# Altium schematic sheet E-13 USB2 C.SchDoc: FRDM-IMX93
size 513 x 386 mm; DrawnBy: FORLINX; Organization: ORGANIZATION; Address1: ADDRESS 1; Address2: ADDRESS 2; Address3: ADDRESS 3; Address4: ADDRESS 4; Revision: -; ENG_APP_DATE: --/--/--; DSN_APP_DATE: --/--/--; CHK_APP_DATE: --/--/--; Classification: Public, Company Internal/Proprietary, Company Confidential,  Company Secret; Page Create Date: March  8, 1995; OrgName: NXP Semiconductor; FIUO: A; OrgAddr1: NO. 192 Liangjing Rd. Pudong New Area, ShangHai; Page Number: 13; PageTitle: USB2 Type-C; Page Size: C; Page Count: 23; Designer: FORLINX; RevCode: B1; Approver: NXP SE; Doc: SCH-94611 PDF: SPF-94611; DsnPath: T:\FILES\Designs\Single Board Computers\i.MX93-FRDM\Design Files\SCH-94611_B1.DSN; SchematicName: FRDM-i.MX 93 Development Board; PageName: E-13 USB2 C; PageSize: C; TopSchematic: True
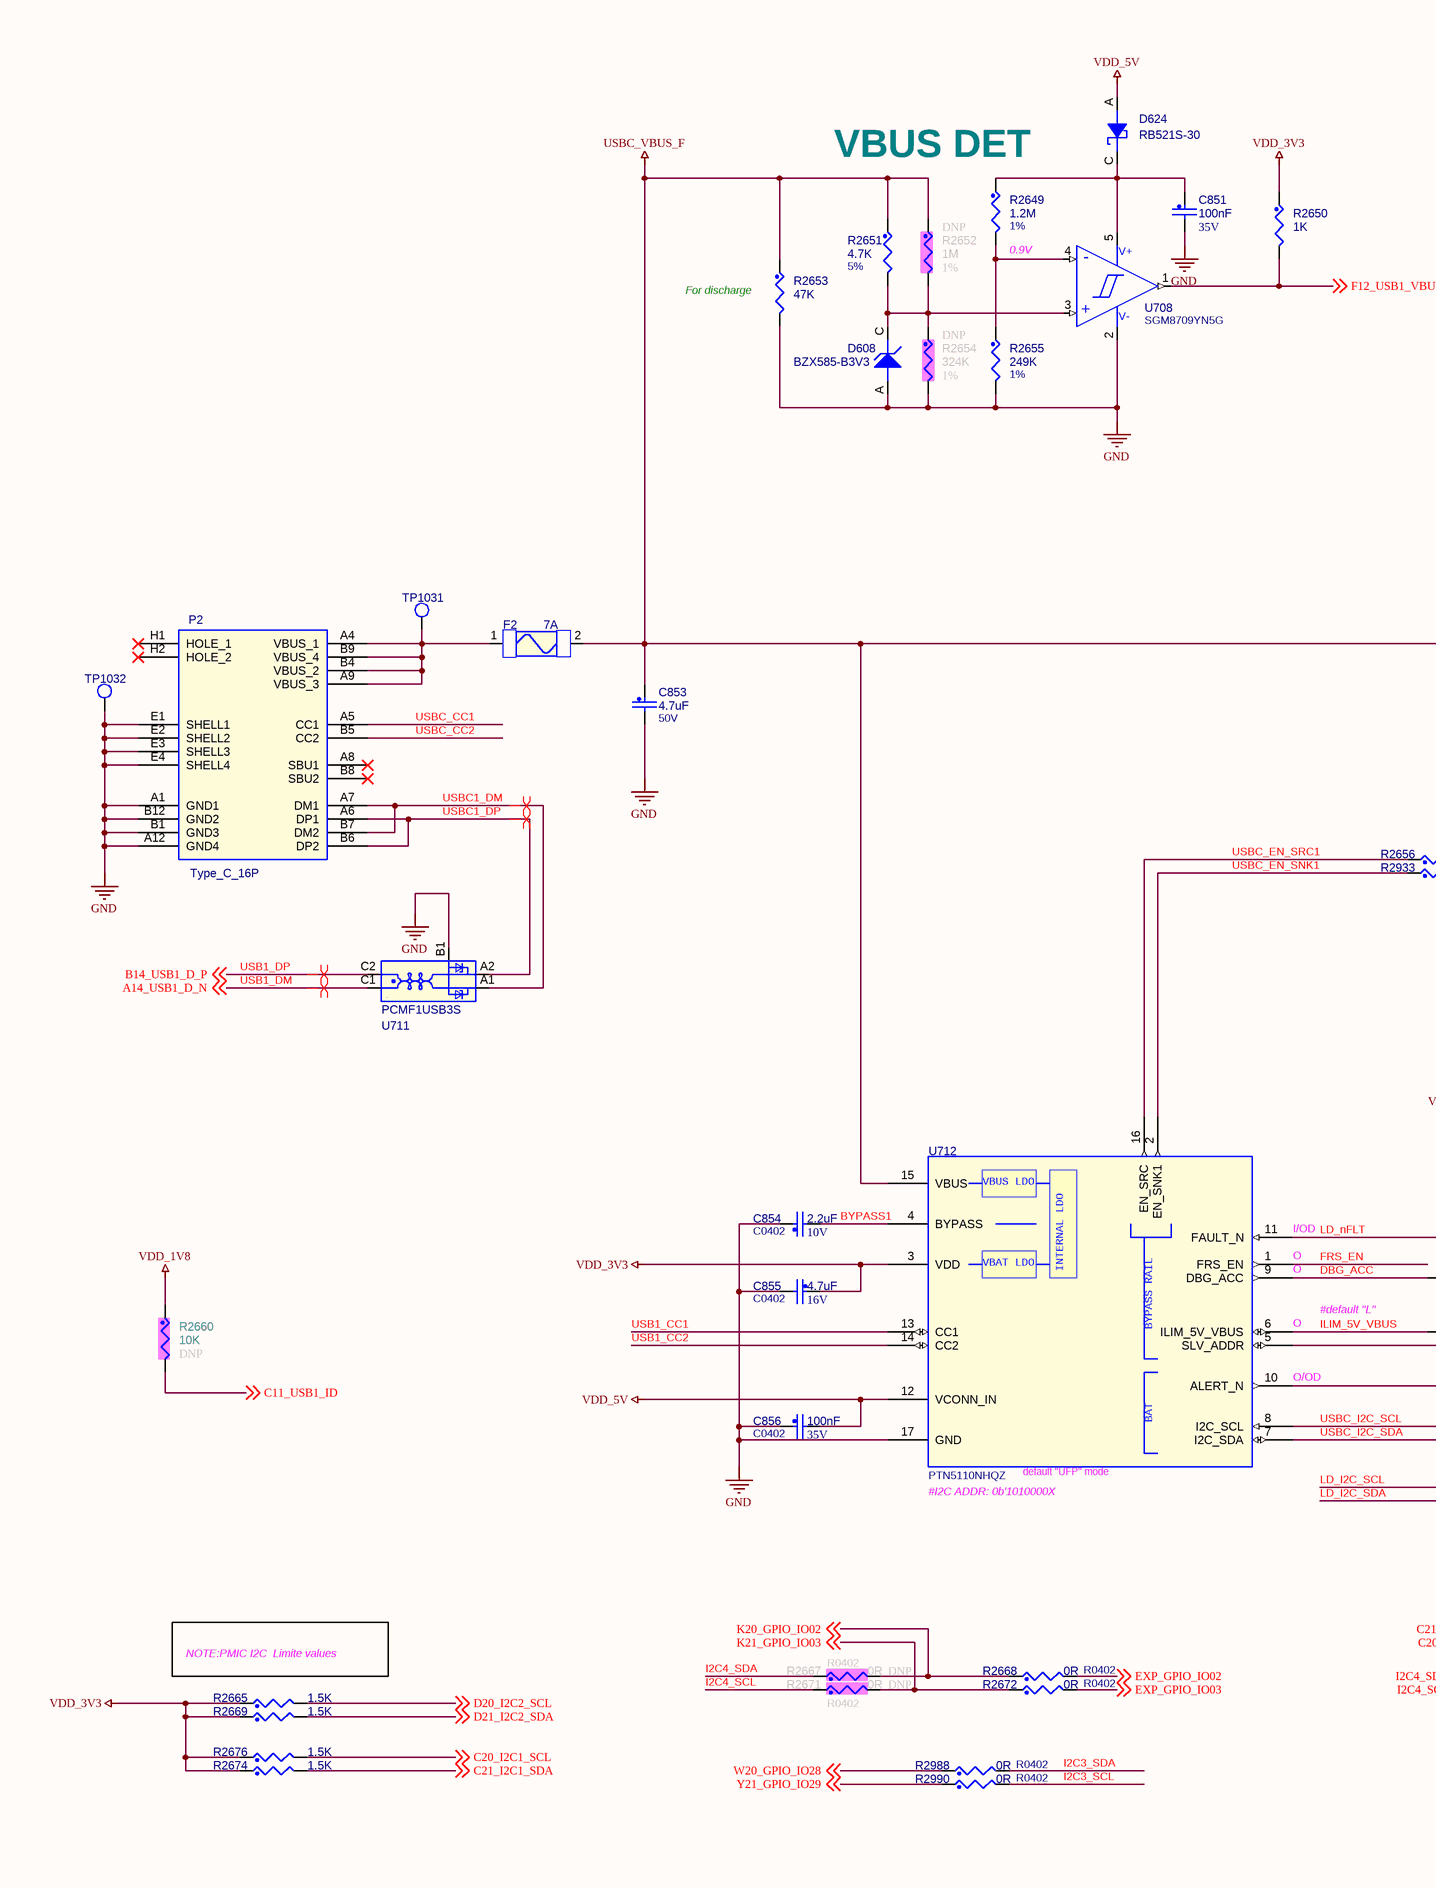
[diagram p0: E-13 USB2 C.SchDoc, left]
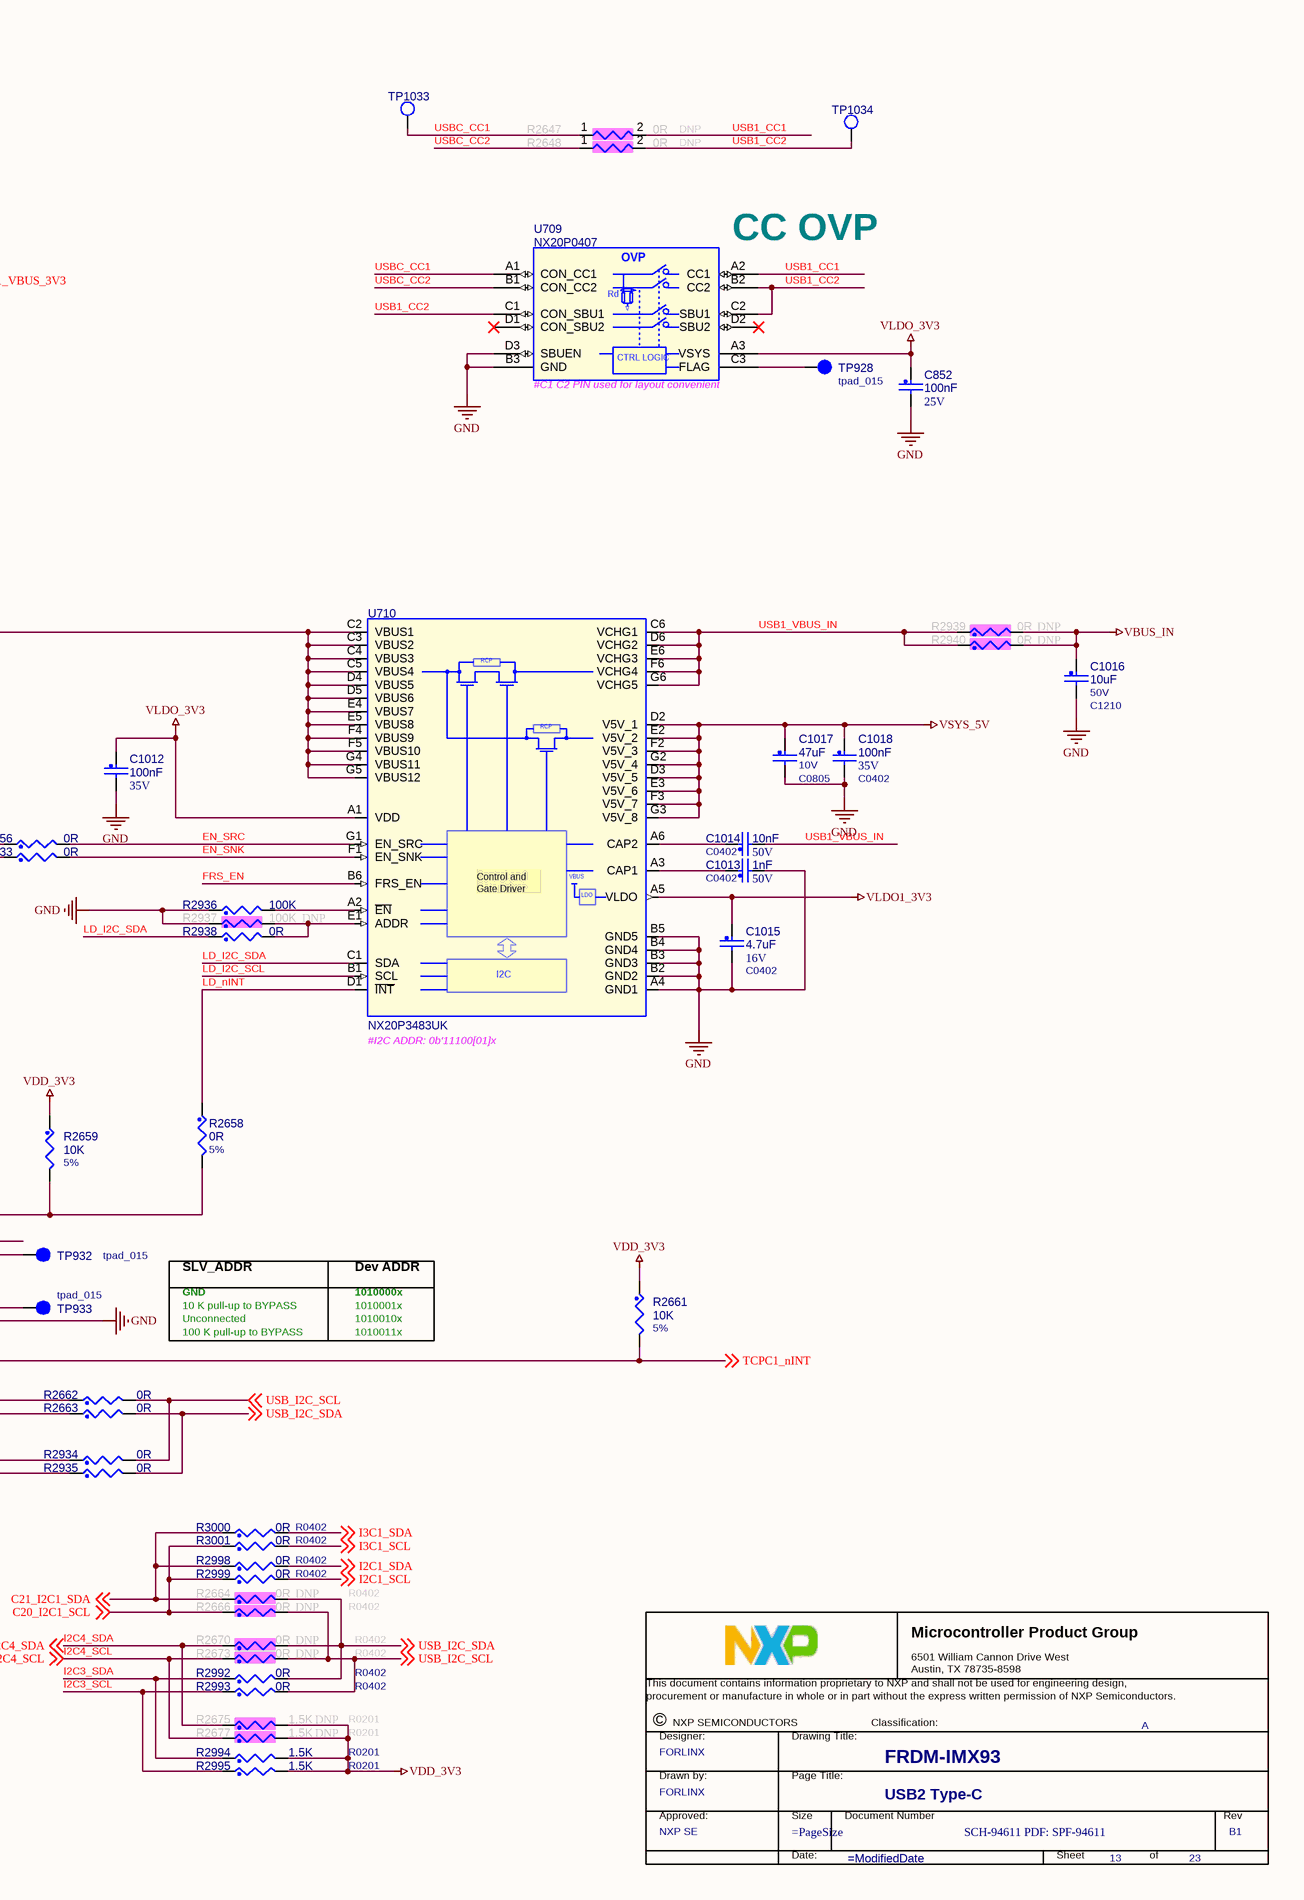
[diagram p1: E-13 USB2 C.SchDoc, right]

## Parts
*  Title: FRDM-IMX93  RevCode: B1  PageTitle: USB2 Type-C  Page Number: 13  Page Count: 23  DrawnBy: FORLINX  Doc: SCH-94611 PDF: SPF-94611  Approver: NXP SE  FIUO: A  (graphical)
C851  100nF  VOLTAGE: 35V  [C0402]
C852  100nF  VOLTAGE: 25V  [C0201]
C853  4.7uF  VOLTAGE: 50V  [C1210]
C854  2.2uF  VOLTAGE: 10V  [C0402]
C855  4.7uF  VOLTAGE: 16V  [C0402]
C856  100nF  VOLTAGE: 35V  [C0402]
C1012  100nF  VOLTAGE: 35V  [C0402]
C1013  1nF  VOLTAGE: 50V  [C0402]
C1014  10nF  VOLTAGE: 50V  [C0402]
C1015  4.7uF  VOLTAGE: 16V  [C0402]
C1016  10uF  VOLTAGE: 50V  [C1210]
C1017  47uF  VOLTAGE: 10V  [C0805]
C1018  100nF  VOLTAGE: 35V  [C0402]
D608  BZX585-B3V3  [sod523]
D624  RB521S-30  [SOD523]
F2  7A  [fuse_3p4x1p8]
P2  Type_C_16P  [TypeC_16P_S]
R2647  0R  ASSY_OPT: DNP  [R0201]
R2648  0R  ASSY_OPT: DNP  [R0201]
R2649  1.2M  Tolerance: 1%  [R0402]
R2650  1K  [R0201]
R2651  4.7K  Tolerance: 5%  [R0402]
R2652  1M  ASSY_OPT: DNP  Tolerance: 1%  [R0402]
R2653  47K  [R0603]
R2654  324K  ASSY_OPT: DNP  Tolerance: 1%  [R0402]
R2655  249K  Tolerance: 1%  [R0402]
R2656  0R  [R0201]
R2658  0R  Tolerance: 5%  [R0201]
R2659  10K  Tolerance: 5%  [R0201]
R2660  10K  ASSY_OPT: DNP  [R0201]
R2661  10K  Tolerance: 5%  [R0201]
R2662  0R  [R0201]
R2663  0R  [R0201]
R2664  0R  ASSY_OPT: DNP  [R0402]
R2665  1.5K  [R0201]
R2666  0R  ASSY_OPT: DNP  [R0402]
R2667  0R  ASSY_OPT: DNP  [R0402]
R2668  0R  [R0402]
R2669  1.5K  [R0201]
R2670  0R  ASSY_OPT: DNP  [R0402]
R2671  0R  ASSY_OPT: DNP  [R0402]
R2672  0R  [R0402]
R2673  0R  ASSY_OPT: DNP  [R0402]
R2674  1.5K  [R0201]
R2675  1.5K  ASSY_OPT: DNP  [R0201]
R2676  1.5K  [R0201]
R2677  1.5K  ASSY_OPT: DNP  [R0201]
R2933  0R  [R0201]
R2934  0R  [R0201]
R2935  0R  [R0201]
R2936  100K  [R0201]
R2937  100K  ASSY_OPT: DNP  [R0201]
R2938  0R  [R0201]
R2939  0R  ASSY_OPT: DNP  [R0805]
R2940  0R  ASSY_OPT: DNP  [R0805]
R2988  0R  [R0402]
R2990  0R  [R0402]
R2992  0R  [R0402]
R2993  0R  [R0402]
R2994  1.5K  [R0201]
R2995  1.5K  [R0201]
R2998  0R  [R0402]
R2999  0R  [R0402]
R3000  0R  [R0402]
R3001  0R  [R0402]
TP928  TPAD_015  [tpad_015]
TP932  TPAD_015  [tpad_015]
TP933  TPAD_015  [tpad_015]
TP1031  TPAD_020  [tpad_020]  (value not drawn)
TP1032  TPAD_020  [tpad_020]  (value not drawn)
TP1033  TPAD_020  [tpad_020]  (value not drawn)
TP1034  TPAD_020  [tpad_020]  (value not drawn)
U708  SGM8709YN5G  [SOT-23-5]
U709  NX20P0407  [wlcsp12_0p4_1p3x1p7mm_smdp]
U710  NX20P3483UK  [wlcsp42_0p4_2p94x2p54_smdp]
U711  PCMF1USB3S  [wlcsp5_0p4_0p82x1p22]
U712  MFG_PN01: PTN5110NHQZ  [hx2qfn16_0p4_2p7x2p7]  (hidden comment: PTN5110)

## Nets
GND: C851.2 C852.2 C853.2 C854.1 C855.2 C856.1 C1012.2 C1013.2 C1015.2 C1016.2 C1017.2 C1018.2 D608.A(ANODE) P2.A1(GND1) P2.A12(GND4) P2.B1(GND3) P2.B12(GND2) P2.E1(SHELL1) P2.E2(SHELL2) P2.E3(SHELL3) P2.E4(SHELL4) R2653.2 R2654.2 R2655.2 R2936.1 R2937.1 TP1032.1(TP) U708.2(V-) U709.B3(GND) U709.D3(SBUEN) U710.A4(GND1) U710.B2(GND2) U710.B3(GND3) U710.B4(GND4) U710.B5(GND5) U711.B1(GND) U712.5(SLV_ADDR) U712.17(GND)
USBC_VBUS_F: C853.1 F2.2 R2651.1 R2652.1 R2653.1 U710.C2(VBUS1) U710.C3(VBUS2) U710.C4(VBUS3) U710.C5(VBUS4) U710.D4(VBUS5) U710.D5(VBUS6) U710.E4(VBUS7) U710.E5(VBUS8) U710.F4(VBUS9) U710.F5(VBUS10) U710.G4(VBUS11) U710.G5(VBUS12) U712.15(VBUS)
VBUS_IN: C1016.1 R2939.2 R2940.2
VDD_1V8: R2660.1
VDD_3V3: C855.1 R2650.1 R2659.1 R2661.1 R2665.1 R2669.1 R2674.1 R2675.2 R2676.1 R2677.2 R2994.2 R2995.2 U712.3(VDD)
VDD_5V: C856.2 D624.A U712.12(VCONN_IN)
VLDO1_3V3: C1015.1 U710.A5(VLDO)
VLDO_3V3: C852.1 C1012.1 U709.A3(VSYS) U710.A1(VDD)
VSYS_5V: C1017.1 C1018.1 U710.D2(V5V_1) U710.D3(V5V_5) U710.E2(V5V_2) U710.E3(V5V_6) U710.F2(V5V_3) U710.F3(V5V_7) U710.G2(V5V_4) U710.G3(V5V_8)
BYPASS1: C854.2 U712.4(BYPASS)
C11_USB1_ID: R2660.2 ; off-sheet C11_USB1_ID
C20_I2C1_SCL: R2666.1 R2676.2 R2999.1 R3001.1 ; off-sheet C20_I2C1_SCL
C21_I2C1_SDA: R2664.1 R2674.2 R2998.1 R3000.1 ; off-sheet C21_I2C1_SDA
D20_I2C2_SCL: R2665.2 ; off-sheet D20_I2C2_SCL
D21_I2C2_SDA: R2669.2 ; off-sheet D21_I2C2_SDA
DBG_ACC: TP932.1(Pin1) U712.9(DBG_ACC)
EN_SNK: R2933.2 U710.F1(EN_SNK)
EN_SRC: R2656.2 U710.G1(EN_SRC)
EXP_GPIO_IO02: R2668.2 ; off-sheet EXP_GPIO_IO02
EXP_GPIO_IO03: R2672.2 ; off-sheet EXP_GPIO_IO03
F12_USB1_VBUS_3V3: R2650.2 U708.1(OUT) ; off-sheet F12_USB1_VBUS_3V3
FRS_EN: U710.B6(FRS_EN) U712.1(FRS_EN)
I2C1_SCL: R2999.2 ; off-sheet I2C1_SCL
I2C1_SDA: R2998.2 ; off-sheet I2C1_SDA
I2C3_SCL: R2990.2 R2993.1 R2995.1
I2C3_SDA: R2988.2 R2992.1 R2994.1
I2C4_SCL: R2671.1 R2673.1 R2677.1 ; off-sheet I2C4_SCL
I2C4_SDA: R2667.1 R2670.1 R2675.1 ; off-sheet I2C4_SDA
I3C1_SCL: R3001.2 ; off-sheet I3C1_SCL
I3C1_SDA: R3000.2 ; off-sheet I3C1_SDA
ILIM_5V_VBUS: TP933.1(Pin1) U712.6(ILIM_5V_VBUS)
K20_GPIO_IO02: R2667.2 R2668.1 ; off-sheet K20_GPIO_IO02
K21_GPIO_IO03: R2671.2 R2672.1 ; off-sheet K21_GPIO_IO03
LD_I2C_SCL: R2934.1 U710.B1(SCL)
LD_I2C_SDA: R2935.1 R2938.1 U710.C1(SDA)
LD_nFLT: R2658.2 R2659.2 U712.11(FAULT_N)
LD_nINT: R2658.1 U710.D1(~{INT})
TCPC1_nINT: R2661.2 U712.10(ALERT_N) ; off-sheet TCPC1_nINT
USB1_CC1: R2647.2 U709.A2(CC1) U712.13(CC1)
USB1_CC2: R2648.2 TP1034.1(TP) U709.B2(CC2) U709.C1(CON_SBU1) U709.C2(SBU1) U712.14(CC2)
USB1_DM: U711.C1(CH1_OUT+) ; off-sheet A14_USB1_D_N  [also labelled A14_USB1_D_N]
USB1_DP: U711.C2(CH1_OUT-) ; off-sheet B14_USB1_D_P  [also labelled B14_USB1_D_P]
USB1_VBUS_IN: C1014.2 R2939.1 R2940.1 U710.C6(VCHG1) U710.D6(VCHG2) U710.E6(VCHG3) U710.F6(VCHG4) U710.G6(VCHG5)
USB_I2C_SCL: R2662.2 R2666.2 R2673.2 R2934.2 R2993.2 ; off-sheet USB_I2C_SCL
USB_I2C_SDA: R2663.2 R2664.2 R2670.2 R2935.2 R2992.2 ; off-sheet USB_I2C_SDA
USBC1_DM: P2.A7(DM1) P2.B7(DM2) U711.A1(CH1_IN+)
USBC1_DP: P2.A6(DP1) P2.B6(DP2) U711.A2(CH1_IN-)
USBC_CC1: P2.A5(CC1) R2647.1 TP1033.1(TP) U709.A1(CON_CC1)
USBC_CC2: P2.B5(CC2) R2648.1 U709.B1(CON_CC2)
USBC_EN_SNK1: R2933.1 U712.2(EN_SNK1)
USBC_EN_SRC1: R2656.1 U712.16(EN_SRC)
USBC_I2C_SCL: R2662.1 U712.8(I2C_SCL)
USBC_I2C_SDA: R2663.1 U712.7(I2C_SDA)
W20_GPIO_IO28: R2988.1 ; off-sheet W20_GPIO_IO28
Y21_GPIO_IO29: R2990.1 ; off-sheet Y21_GPIO_IO29
NetC851_1: C851.1 D624.C R2649.1 U708.5(V+)
NetC1013_1: C1013.1 U710.A3(CAP1)
NetC1014_1: C1014.1 U710.A6(CAP2)
NetD608_C: D608.C(CATHODE) R2651.2 R2652.2 R2654.1 U708.3(+IN)
NetF2_1: F2.1 P2.A4(VBUS_1) P2.A9(VBUS_3) P2.B4(VBUS_2) P2.B9(VBUS_4) TP1031.1(TP)
NetR2649_2: R2649.2 R2655.1 U708.4(-IN)
NetR2936_2: R2936.2 U710.A2(~{EN})
NetR2937_2: R2937.2 R2938.2 U710.E1(ADDR)
NetTP928_1: TP928.1(Pin1) U709.C3(FLAG)

Not connected (* = marked no-connect by the designer): P2 A8(SBU1)* B8(SBU2)* H1(HOLE_1)* H2(HOLE_2)*; U709 D1(CON_SBU2)* D2(SBU2)*

## Layout directives
differential pair: USB1_DM, USB1_DP, USBC1_DM, USBC1_DP

## Notes on the sheet
- (near R2649) VBUS DET
- (near R2649) 0.9V
- (near U709) CC OVP
- (near R2653) For discharge
- (near U709) #C1 C2 PIN used for layout convenient
- (near U710) #I2C ADDR: 0b'11100[01]x
- (near U712) O
- (near U712) I/OD
- #default "L"
- GND
- 10 K pull-up to BYPASS
- SLV_ADDR
- 1010001x
- Dev ADDR
- 1010000x
- (near U712) O/OD
- 100 K pull-up to BYPASS
- Unconnected
- 1010011x
- 1010010x
- (near U712) #I2C ADDR: 0b'1010000X
- (near U712) default "UFP" mode
- NOTE:PMIC I2C  Limite values
- DWG. NO.
- REV.
- SHT.
- REVISION
- DESCRIPTION
- DATE
- APPROVED
- ENG:
- APPROVALS
- quilter.ai <http://quilter.ai>
- DSN:
- CHK:
- REFERENCE DOCUMENTS
- TITLE
- PROJECT
- BOM:
- FAB DWG:
- PCB DWG:
- ASSY DWG:
- SIZE
- FILE NAME
- C
- DWG NO.
- SHEET
- OF
- REV
- (in symbol NX20P0407_WLCSP12_A) OVP; Rd; CTRL LOGIC
- (in symbol NX20P3483UK_42P) RCP; VBUS; Control and / Gate Driver; LDO; I2C
- (in symbol PTN5110_QFN16) VBUS LDO; VBAT LDO; INTERNAL LDO; BYPASS RAIL; BAT
- (in symbol SGM8709YN5G) -; +
- (in symbol TitleBlock_MCPG) Microcontroller Product Group; 6501 William Cannon Drive West / Austin, TX 78735-8598; This document contains information proprietary to NXP and shall not be used for engineering design,; procurement or manufacture in whole or in part without the express written permission of NXP Semiconductors.; ©; NXP SEMICONDUCTORS; Classification:; Designer:; Drawing Title:; Drawn by:; Page Title:; Approved:; Size; Document Number; Rev; Date:; Sheet; of

## Library data of the parts
* = TitleBlock_MCPG: Classification: Public, Company Internal/Proprietary, Company Confidential,  Company Secret; OrgAddr1: NO. 192 Liangjing Rd. Pudong New Area, ShangHai; OrgName: NXP Semiconductor; Page Size: =PageSize; Page Create Date: March  8, 1995; Designer: FORLINX; Page Modify Date: =ModifiedDate
C851 = CAP_NP: 0402,100nF,50V,+/-10%,X5R; Part Reference: C851; CLASS: DISCRETE; Tolerance: 10%; MFG_NAME01: FENGHUA; MFG_PN01: 0402X104K500NT; CAD_APPROVED: Yes; FPLIST: CC0402_25,CC0402_HD,0402_CC,capc0402_l; Value: 100nF; ROHS: Yes; HEIGHT: 0.55MM; PCB Footprint: C0402
C852 = CAP_NP: 0201,100nF,25V,+/-10%,X5R; Part Reference: C852; CLASS: DISCRETE; FPLIST: CC0402_25,CC0402_HD,0402_CC,capc0402_l; CAD_APPROVED: Yes; MFG_PN01: 0201X104K250NT; MFG_NAME01: FENGHUA; Tolerance: 10%; Value: 100nF; HEIGHT: 0.55MM; ROHS: Yes; PCB Footprint: C0201
C853 = CAP_NP: 1210,4.7uF,50V,+/-10%,X7R; Part Reference: C853; CLASS: DISCRETE; Tolerance: 10%; MFG_NAME01: MURATA; MFG_PN01: GRM32ER71H475KA88L; CAD_APPROVED: Yes; FPLIST: CC1210,1210_CC; Value: 4.7uF; ROHS: Yes; HEIGHT: 2.7MM; PCB Footprint: C1210
C854 = CAP_NP: 0402,2.2uF,10V,+/-10%,X5R; Part Reference: C854; CLASS: DISCRETE; Tolerance: 10%; MFG_NAME01: SAMSUNG; MFG_PN01: CL05A225KP5NSNC; CAD_APPROVED: Yes; FPLIST: CC0402_25,CC0402_HD,0402_CC,capc0402_l; Value: 2.2uF; Package Size: 0402; ROHS: Yes; HEIGHT: 0.55 MM; PCB Footprint: C0402
C855 = CAP_NP: 0402,4.7uF,10V,+/-10%,X5R; Part Reference: C855; CLASS: DISCRETE; Temp Range: -55¡ãC to + 85¡ãC; FPLIST: CC0603_OV,CC0603,cc0603_0805_nsp,0603_CC_NSP; CAD_APPROVED: Yes; MFG_PN01: CL05A475KP5NRNC; MFG_NAME01: SAMSUNG; Value: 4.7uF; HEIGHT: 0.95MM; ROHS: Yes; PCB Footprint: C0402
C856 = CAP_NP: 0402,100nF,50V,+/-10%,X5R; Part Reference: C856; CLASS: DISCRETE; FPLIST: CC0402_25,CC0402_HD,0402_CC,capc0402_l; CAD_APPROVED: Yes; MFG_PN01: 0402X104K500NT; MFG_NAME01: FENGHUA; Tolerance: 10%; Value: 100nF; HEIGHT: 0.55MM; ROHS: Yes; PCB Footprint: C0402
C1012 = CAP_NP: 0402,100nF,50V,+/-10%,X5R; Part Reference: C1012; CLASS: DISCRETE; FPLIST: CC0402_25,CC0402_HD,0402_CC,capc0402_l; CAD_APPROVED: Yes; MFG_PN01: 0402X104K500NT; MFG_NAME01: FENGHUA; Tolerance: 10%; Value: 100nF; HEIGHT: 0.55MM; ROHS: Yes; PCB Footprint: C0402
C1013 = CAP_NP: 0402,1nF,50V,+/-10%,X7R; Part Reference: C1013; CLASS: DISCRETE; Tolerance: 10%; MFG_NAME01: FENGHUA; MFG_PN01: 0402B102K500NT; CAD_APPROVED: Yes; FPLIST: CC0402_25,CC0402_HD,0402_CC,capc0402_l; Value: 1nF; ROHS: Yes; HEIGHT: 0.55MM; PCB Footprint: C0402
C1014 = CAP_NP: 0402,10nF,50V,+/-10%,X7R; Part Reference: C1014; CLASS: DISCRETE; Tolerance: 10%; MFG_NAME01: FENGHUA; MFG_PN01: 0402CG103J500NT; CAD_APPROVED: Yes; FPLIST: CC0402_25,CC0402_HD,0402_CC,capc0402_l; Value: 10nF; ROHS: Yes; HEIGHT: 0.55MM; PCB Footprint: C0402
C1015 = CAP_NP: 0402,4.7uF,10V,+/-10%,X5R; Part Reference: C1015; CLASS: DISCRETE; Tolerance: 10%; MFG_NAME01: SAMSUNG; MFG_PN01: CL05A475KP5NRNC; CAD_APPROVED: Yes; FPLIST: CC0402_25,CC0402_HD,0402_CC,capc0402_l; Value: 4.7uF; ROHS: Yes; HEIGHT: 0.55MM; PCB Footprint: C0402
C1016 = CAP_NP: 1210,10uF,50V,+/-10%,X7R; Part Reference: C1016; CLASS: DISCRETE; Tolerance: 10%; MFG_NAME01: SAMSUNG; MFG_PN01: CL32B106KBJNNNE; CAD_APPROVED: Yes; FPLIST: CC1210,1210_CC; Value: 10uF; ROHS: Yes; HEIGHT: 2.7MM; PCB Footprint: C1210
C1017 = CAP_NP: 0805,47uF,10V,+/-20%,X5R; Part Reference: C1017; CLASS: DISCRETE; Tolerance: 10%; MFG_NAME01: MURATA; MFG_PN01: GRM21BR61A476ME15L; CAD_APPROVED: Yes; FPLIST: CC1210,1210_CC; Value: 47uF; ROHS: Yes; HEIGHT: 2.7MM; PCB Footprint: C0805
C1018 = CAP_NP: 0402,100nF,50V,+/-10%,X5R; Part Reference: C1018; CLASS: DISCRETE; Tolerance: 10%; MFG_NAME01: FENGHUA; MFG_PN01: 0402X104K500NT; CAD_APPROVED: Yes; FPLIST: CC0402_25,CC0402_HD,0402_CC,capc0402_l; Value: 100nF; ROHS: Yes; HEIGHT: 0.55MM; PCB Footprint: C0402
D608 = ZDIODE: BZX585-B3V3,3.3V,SOD523; Part Reference: D608; CLASS: IC; MFG_NAME01: JSCJ; Temp_Range: -65¡ãC to +150¡ãC; CAD_APPROVED: Yes; Value: BZX585-B3V3; MFG_PN01: BZX585-B3V3; ROHS: Yes; HEIGHT: 0.65MM; Temp Range: -65¡ãC to +150¡ãC; PCB Footprint: sod523
D624 = DIODE_SCHTKY: RB521S-30C,SOD-523; Part Reference: D624; CLASS: IC; MFG_NAME01: onsemi; CAD_APPROVED: Yes; Value: RB521S-30; MFG_PN01: RB521S-30C; ROHS: Yes; HEIGHT: 0.7MM; PCB Footprint: SOD523
F2 = FUSE: Fuse,1206,7A,32V; Part Reference: F2; CLASS: DISCRETE; CAD_APPROVED: Yes; MFG_PN01: JFC1206-1700FS; MFG_NAME01: JDT fuse; Value: 7A; HEIGHT: 0.8639MM; ROHS: Yes; PCB Footprint: fuse_3p4x1p8
P2 = Type_C_16P: USB616FC-C2014216,USB2.0,type-c; Part Reference: P2; MFG_NAME01: ATOM; Value: Type_C_16P; MFG_PN01: USB616FC-C2014216; PCB Footprint: TypeC_16P_S
R2647 = RESISTOR: 0201,0Ohm,+/-5%; Part Reference: R2647; Manufacturer: YAGEO; Tolerance: 1%; MFG_NAME01: FENGHUA; RK PN: RC0402FR-0743KL; Priority: A; Wattage: 1/16W; MFG_PN01: RC-01000JT; PCB Footprint: R0201; Value: 0R; Part Type: Í¨ÓÃºñÄ¤µç×è; Manufacturer PN: RC0402FR-0743KL; Created by: YTL
R2648 = RESISTOR: 0201,0Ohm,+/-5%; Part Reference: R2648; Manufacturer: YAGEO; Tolerance: 1%; MFG_NAME01: FENGHUA; RK PN: RC0402FR-0743KL; Priority: A; Wattage: 1/16W; MFG_PN01: RC-01000JT; PCB Footprint: R0201; Value: 0R; Part Type: Í¨ÓÃºñÄ¤µç×è; Manufacturer PN: RC0402FR-0743KL; Created by: YTL
R2649 = RES: 0402,1.2M,+/-1%; Part Reference: R2649; CLASS: DISCRETE; MFG_NAME01: FENGHUA; MFG_PN01: RC-02U1204FT; Temp_Range: -55C to +155C; CAD_APPROVED: Yes; FPLIST: RC0402_25,RC0402_HD,0402_CC; VOLTAGE: 50V; Value: 1.2M; ROHS: Yes; HEIGHT: 0.40 MM; Temp Range: -55C to +155C; PCB Footprint: R0402
R2650 = RES: 0201,1K,+/-1%; Part Reference: R2650; CLASS: DISCRETE; TOL: 5%; MFG_NAME01: FENGHUA; MFG_PN01: RC-01W1001FT; CAD_APPROVED: Yes; FPLIST: RC0402_25,RC0402_HD,RC0402_X2,0402_CC,CAPC0402_L; Value: 1K; HEIGHT: 0.41mm; Tolerance: 5%; ROHS: Yes; PCB Footprint: R0201
R2651 = RES: 0402,4.7K,+/-1%; Part Reference: R2651; CLASS: DISCRETE; MFG_NAME01: FENGHUA; MFG_PN01: RC-02K4701FT; CAD_APPROVED: Yes; FPLIST: RC0402_25,RC0402_HD,0402_CC,RC0402_X2; Value: 4.7K; ROHS: Yes; HEIGHT: 0.41mm; PCB Footprint: R0402
R2652 = RES: 0402,1M,+/-1%; Part Reference: R2652; CLASS: DISCRETE; MFG_NAME01: FENGHUA; MFG_PN01: RC-02K1004FT; CAD_APPROVED: Yes; FPLIST: RC0402_25,RC0402_HD,0402_CC; Value: 1M; ROHS: Yes; HEIGHT: 0.4MM; PCB Footprint: R0402
R2653 = RES: 0603,47K,+/-1%; Part Reference: R2653; CLASS: DISCRETE; FPLIST: RC0603_OV,RC0603,0603_CC; Tolerance: 5%; CAD_APPROVED: Yes; MFG_NAME01: FENGHUA; MFG_PN01: RS-03K4702FT; Value: 47K; HEIGHT: 0.55 MM; ROHS: Yes; PCB Footprint: R0603
R2654 = RES: 0402,324K,+/-1%; Part Reference: R2654; CLASS: DISCRETE; FPLIST: RC0402_25,RC0402_HD,0402_CC; CAD_APPROVED: Yes; MFG_NAME01: FENGHUA; MFG_PN01: RC-02W3243FT; Value: 324K; HEIGHT: 0.40 MM; ROHS: Yes; PCB Footprint: R0402
R2655 = RES: 0402,249K,+/-1%; Part Reference: R2655; CLASS: DISCRETE; MFG_NAME01: FENGHUA; MFG_PN01: RC-02W2493FT; Temp_Range: -55C to +155C; CAD_APPROVED: Yes; FPLIST: RC0402_25,RC0402_HD,0402_CC; Value: 249K; ROHS: Yes; HEIGHT: 0.40 MM; Temp Range: -55C to +155C; PCB Footprint: R0402
R2656 = RES: 0201,0Ohm,+/-5%; Part Reference: R2656; CLASS: DISCRETE; VOLTAGE: 1/16W; Tolerance: 5%; MFG_NAME01: FENGHUA; MFG_PN01: RC-01000JT; CAD_APPROVED: Yes; FPLIST: RC0402_25,RC0402_HD,RC0402_X2,0402_CC; Value: 0R; HEIGHT: 0.45 MM; ROHS: Yes; PCB Footprint: R0201
R2658 = RES: 0201,0Ohm,+/-5%; Part Reference: R2658; CLASS: DISCRETE; MFG_NAME01: FENGHUA; MFG_PN01: RC-01000JT; CAD_APPROVED: Yes; FPLIST: RC0402_25,RC0402_HD,RC0402_X2,0402_CC; VOLTAGE: 1/16W; Value: 0R; ROHS: Yes; HEIGHT: 0.45 MM; PCB Footprint: R0201
R2659 = RES: 0201,10K,+/-5%; Part Reference: R2659; CLASS: DISCRETE; MFG_NAME01: FENGHUA; MFG_PN01: RC-01W103JT; CAD_APPROVED: Yes; FPLIST: RC0402_25,RC0402_HD,0402_CC; Value: 10K; ROHS: Yes; HEIGHT: 0.4 MM; PCB Footprint: R0201
R2660 = RES: 0201,10K,+/-5%; Part Reference: R2660; CLASS: DISCRETE; TOL: 5%; MFG_NAME01: FENGHUA; MFG_PN01: RC-01W103JT; CAD_APPROVED: Yes; FPLIST: RC0402_25,RC0402_HD,RC0402_X2,0402_CC,CAPC0402_L; Value: 10K; HEIGHT: 0.41mm; Tolerance: 5%; ROHS: Yes; PCB Footprint: R0201
R2661 = RES: 0201,10K,+/-5%; Part Reference: R2661; CLASS: DISCRETE; MFG_NAME01: FENGHUA; MFG_PN01: RC-01W103JT; CAD_APPROVED: Yes; FPLIST: RC0402_25,RC0402_HD,0402_CC; Value: 10K; ROHS: Yes; HEIGHT: 0.4 MM; PCB Footprint: R0201
R2662 = RES: 0201,0Ohm,+/-5%; Part Reference: R2662; CLASS: DISCRETE; FPLIST: RC0402_25,RC0402_HD,RC0402_X2,0402_CC; CAD_APPROVED: Yes; MFG_PN01: RC-01000JT; MFG_NAME01: FENGHUA; Tolerance: 5%; VOLTAGE: 1/16W; Value: 0R; ROHS: Yes; HEIGHT: 0.45 MM; PCB Footprint: R0201
R2663 = RES: 0201,0Ohm,+/-5%; Part Reference: R2663; CLASS: DISCRETE; FPLIST: RC0402_25,RC0402_HD,RC0402_X2,0402_CC; CAD_APPROVED: Yes; MFG_PN01: RC-01000JT; MFG_NAME01: FENGHUA; Tolerance: 5%; VOLTAGE: 1/16W; Value: 0R; ROHS: Yes; HEIGHT: 0.45 MM; PCB Footprint: R0201
R2664 = RES: 0402,0Ohm,+/-1%; Part Reference: R2664; CLASS: DISCRETE; VOLTAGE: 1/16W; Tolerance: 5%; MFG_NAME01: FENGHUA; MFG_PN01: RC-02000FT; CAD_APPROVED: Yes; FPLIST: RC0402_25,RC0402_HD,RC0402_X2,0402_CC; Value: 0R; HEIGHT: 0.45 MM; ROHS: Yes; PCB Footprint: R0402
R2665 = RES: 0201,1.5K,+/-1%; Part Reference: R2665; CLASS: DISCRETE; Temp Range: -55C to +155C; Tolerance: 5%; MFG_NAME01: FENGHUA; MFG_PN01: RC-01W1501FT; CAD_APPROVED: Yes; FPLIST: RC0402_25,RC0402_HD,0402_CC,RC0402_X2; VOLTAGE: 50V; Value: 1.5K; ROHS: Yes; Temp_Range: -55C to +155C; HEIGHT: 0.41mm; PCB Footprint: R0201
R2666 = RES: 0402,0Ohm,+/-1%; Part Reference: R2666; CLASS: DISCRETE; FPLIST: RC0402_25,RC0402_HD,RC0402_X2,0402_CC; CAD_APPROVED: Yes; MFG_PN01: RC-02000FT; MFG_NAME01: FENGHUA; Tolerance: 5%; VOLTAGE: 1/16W; Value: 0R; ROHS: Yes; HEIGHT: 0.45 MM; PCB Footprint: R0402
R2667 = RES: 0402,0Ohm,+/-1%; Part Reference: R2667; CLASS: DISCRETE; FPLIST: RC0402_25,RC0402_HD,RC0402_X2,0402_CC; CAD_APPROVED: Yes; MFG_PN01: RC-02000FT; MFG_NAME01: FENGHUA; Tolerance: 5%; VOLTAGE: 1/16W; Value: 0R; ROHS: Yes; HEIGHT: 0.45 MM; PCB Footprint: R0402
R2668 = RES: 0402,0Ohm,+/-1%; Part Reference: R2668; CLASS: DISCRETE; VOLTAGE: 1/16W; Tolerance: 5%; MFG_NAME01: FENGHUA; MFG_PN01: RC-02000FT; CAD_APPROVED: Yes; FPLIST: RC0402_25,RC0402_HD,RC0402_X2,0402_CC; Value: 0R; HEIGHT: 0.45 MM; ROHS: Yes; PCB Footprint: R0402
R2669 = RES: 0201,1.5K,+/-1%; Part Reference: R2669; CLASS: DISCRETE; Temp Range: -55C to +155C; Tolerance: 5%; MFG_NAME01: FENGHUA; MFG_PN01: RC-01W1501FT; CAD_APPROVED: Yes; FPLIST: RC0402_25,RC0402_HD,0402_CC,RC0402_X2; VOLTAGE: 50V; Value: 1.5K; ROHS: Yes; Temp_Range: -55C to +155C; HEIGHT: 0.41mm; PCB Footprint: R0201
R2670 = RES: 0402,0Ohm,+/-1%; Part Reference: R2670; CLASS: DISCRETE; VOLTAGE: 1/16W; Tolerance: 5%; MFG_NAME01: FENGHUA; MFG_PN01: RC-02000FT; CAD_APPROVED: Yes; FPLIST: RC0402_25,RC0402_HD,RC0402_X2,0402_CC; Value: 0R; HEIGHT: 0.45 MM; ROHS: Yes; PCB Footprint: R0402
R2671 = RES: 0402,0Ohm,+/-1%; Part Reference: R2671; CLASS: DISCRETE; FPLIST: RC0402_25,RC0402_HD,RC0402_X2,0402_CC; CAD_APPROVED: Yes; MFG_PN01: RC-02000FT; MFG_NAME01: FENGHUA; Tolerance: 5%; VOLTAGE: 1/16W; Value: 0R; ROHS: Yes; HEIGHT: 0.45 MM; PCB Footprint: R0402
R2672 = RES: 0402,0Ohm,+/-1%; Part Reference: R2672; CLASS: DISCRETE; FPLIST: RC0402_25,RC0402_HD,RC0402_X2,0402_CC; CAD_APPROVED: Yes; MFG_PN01: RC-02000FT; MFG_NAME01: FENGHUA; Tolerance: 5%; VOLTAGE: 1/16W; Value: 0R; ROHS: Yes; HEIGHT: 0.45 MM; PCB Footprint: R0402
R2673 = RES: 0402,0Ohm,+/-1%; Part Reference: R2673; CLASS: DISCRETE; VOLTAGE: 1/16W; Tolerance: 5%; MFG_NAME01: FENGHUA; MFG_PN01: RC-02000FT; CAD_APPROVED: Yes; FPLIST: RC0402_25,RC0402_HD,RC0402_X2,0402_CC; Value: 0R; HEIGHT: 0.45 MM; ROHS: Yes; PCB Footprint: R0402
R2674 = RES: 0201,1.5K,+/-1%; Part Reference: R2674; CLASS: DISCRETE; Temp Range: -55C to +155C; Tolerance: 5%; MFG_NAME01: FENGHUA; MFG_PN01: RC-01W1501FT; CAD_APPROVED: Yes; FPLIST: RC0402_25,RC0402_HD,0402_CC,RC0402_X2; VOLTAGE: 50V; Value: 1.5K; ROHS: Yes; Temp_Range: -55C to +155C; HEIGHT: 0.41mm; PCB Footprint: R0201
R2675 = RES: 0201,1.5K,+/-1%; Part Reference: R2675; CLASS: DISCRETE; VOLTAGE: 50V; FPLIST: RC0402_25,RC0402_HD,0402_CC,RC0402_X2; CAD_APPROVED: Yes; Temp_Range: -55C to +155C; MFG_PN01: RC-01W1501FT; MFG_NAME01: FENGHUA; Tolerance: 5%; Value: 1.5K; HEIGHT: 0.41mm; ROHS: Yes; Temp Range: -55C to +155C; PCB Footprint: R0201
R2676 = RES: 0201,1.5K,+/-1%; Part Reference: R2676; CLASS: DISCRETE; Temp Range: -55C to +155C; Tolerance: 5%; MFG_NAME01: FENGHUA; MFG_PN01: RC-01W1501FT; CAD_APPROVED: Yes; FPLIST: RC0402_25,RC0402_HD,0402_CC,RC0402_X2; VOLTAGE: 50V; Value: 1.5K; ROHS: Yes; Temp_Range: -55C to +155C; HEIGHT: 0.41mm; PCB Footprint: R0201
R2677 = RES: 0201,1.5K,+/-1%; Part Reference: R2677; CLASS: DISCRETE; VOLTAGE: 50V; FPLIST: RC0402_25,RC0402_HD,0402_CC,RC0402_X2; CAD_APPROVED: Yes; Temp_Range: -55C to +155C; MFG_PN01: RC-01W1501FT; MFG_NAME01: FENGHUA; Tolerance: 5%; Value: 1.5K; HEIGHT: 0.41mm; ROHS: Yes; Temp Range: -55C to +155C; PCB Footprint: R0201
R2933 = RES: 0201,0Ohm,+/-5%; Part Reference: R2933; CLASS: DISCRETE; VOLTAGE: 1/16W; FPLIST: RC0402_25,RC0402_HD,RC0402_X2,0402_CC; CAD_APPROVED: Yes; MFG_PN01: RC-01000JT; MFG_NAME01: FENGHUA; Tolerance: 5%; Value: 0R; HEIGHT: 0.45 MM; ROHS: Yes; PCB Footprint: R0201
R2934 = RES: 0201,0Ohm,+/-5%; Part Reference: R2934; CLASS: DISCRETE; FPLIST: RC0402_25,RC0402_HD,RC0402_X2,0402_CC; CAD_APPROVED: Yes; MFG_PN01: RC-01000JT; MFG_NAME01: FENGHUA; Tolerance: 5%; VOLTAGE: 1/16W; Value: 0R; ROHS: Yes; HEIGHT: 0.45 MM; PCB Footprint: R0201
R2935 = RES: 0201,0Ohm,+/-5%; Part Reference: R2935; CLASS: DISCRETE; FPLIST: RC0402_25,RC0402_HD,RC0402_X2,0402_CC; CAD_APPROVED: Yes; MFG_PN01: RC-01000JT; MFG_NAME01: FENGHUA; Tolerance: 5%; VOLTAGE: 1/16W; Value: 0R; ROHS: Yes; HEIGHT: 0.45 MM; PCB Footprint: R0201
R2936 = RES: 0201,100K,+/-1%; Part Reference: R2936; CLASS: DISCRETE; VOLTAGE: 1/16W; Tolerance: 5%; MFG_NAME01: FENGHUA; MFG_PN01: RC-01W1003FT; CAD_APPROVED: Yes; FPLIST: RC0402_25,RC0402_HD,RC0402_X2,0402_CC; Value: 100K; HEIGHT: 0.45 MM; ROHS: Yes; PCB Footprint: R0201
R2937 = RES: 0201,100K,+/-1%; Part Reference: R2937; CLASS: DISCRETE; FPLIST: RC0402_25,RC0402_HD,RC0402_X2,0402_CC; CAD_APPROVED: Yes; MFG_PN01: RC-01W1003FT; MFG_NAME01: FENGHUA; Tolerance: 5%; VOLTAGE: 1/16W; Value: 100K; ROHS: Yes; HEIGHT: 0.45 MM; PCB Footprint: R0201
R2938 = RES: 0201,0Ohm,+/-5%; Part Reference: R2938; CLASS: DISCRETE; VOLTAGE: 1/16W; Tolerance: 5%; MFG_NAME01: FENGHUA; MFG_PN01: RC-01000JT; CAD_APPROVED: Yes; FPLIST: RC0402_25,RC0402_HD,RC0402_X2,0402_CC; Value: 0R; HEIGHT: 0.45 MM; ROHS: Yes; PCB Footprint: R0201
R2939 = RES: 0805,0Ohm+/-5%; Part Reference: R2939; CLASS: DISCRETE; VOLTAGE: 1/16W; Tolerance: 5%; MFG_NAME01: FENGHUA; MFG_PN01: RS-05000JT; CAD_APPROVED: Yes; FPLIST: RC0402_25,RC0402_HD,RC0402_X2,0402_CC; Value: 0R; HEIGHT: 0.45 MM; ROHS: Yes; PCB Footprint: R0805
R2940 = RES: 0805,0Ohm+/-5%; Part Reference: R2940; CLASS: DISCRETE; VOLTAGE: 1/16W; Tolerance: 5%; MFG_NAME01: FENGHUA; MFG_PN01: RS-05000JT; CAD_APPROVED: Yes; FPLIST: RC0402_25,RC0402_HD,RC0402_X2,0402_CC; Value: 0R; HEIGHT: 0.45 MM; ROHS: Yes; PCB Footprint: R0805
R2988 = RES: 0402,0Ohm,+/-1%; Part Reference: R2988; CLASS: DISCRETE; FPLIST: RC0402_25,RC0402_HD,RC0402_X2,0402_CC; CAD_APPROVED: Yes; MFG_PN01: RC-02000FT; MFG_NAME01: FENGHUA; Tolerance: 5%; VOLTAGE: 1/16W; Value: 0R; ROHS: Yes; HEIGHT: 0.45 MM; PCB Footprint: R0402
R2990 = RES: 0402,0Ohm,+/-1%; Part Reference: R2990; CLASS: DISCRETE; VOLTAGE: 1/16W; Tolerance: 5%; MFG_NAME01: FENGHUA; MFG_PN01: RC-02000FT; CAD_APPROVED: Yes; FPLIST: RC0402_25,RC0402_HD,RC0402_X2,0402_CC; Value: 0R; HEIGHT: 0.45 MM; ROHS: Yes; PCB Footprint: R0402
R2992 = RES: 0402,0Ohm,+/-1%; Part Reference: R2992; CLASS: DISCRETE; FPLIST: RC0402_25,RC0402_HD,RC0402_X2,0402_CC; CAD_APPROVED: Yes; MFG_PN01: RC-02000FT; MFG_NAME01: FENGHUA; Tolerance: 5%; VOLTAGE: 1/16W; Value: 0R; ROHS: Yes; HEIGHT: 0.45 MM; PCB Footprint: R0402
R2993 = RES: 0402,0Ohm,+/-1%; Part Reference: R2993; CLASS: DISCRETE; VOLTAGE: 1/16W; Tolerance: 5%; MFG_NAME01: FENGHUA; MFG_PN01: RC-02000FT; CAD_APPROVED: Yes; FPLIST: RC0402_25,RC0402_HD,RC0402_X2,0402_CC; Value: 0R; HEIGHT: 0.45 MM; ROHS: Yes; PCB Footprint: R0402
R2994 = RES: 0201,1.5K,+/-1%; Part Reference: R2994; CLASS: DISCRETE; VOLTAGE: 50V; FPLIST: RC0402_25,RC0402_HD,0402_CC,RC0402_X2; CAD_APPROVED: Yes; Temp_Range: -55C to +155C; MFG_PN01: RC-01W1501FT; MFG_NAME01: FENGHUA; Tolerance: 5%; Value: 1.5K; HEIGHT: 0.41mm; ROHS: Yes; Temp Range: -55C to +155C; PCB Footprint: R0201
R2995 = RES: 0201,1.5K,+/-1%; Part Reference: R2995; CLASS: DISCRETE; Temp Range: -55C to +155C; Tolerance: 5%; MFG_NAME01: FENGHUA; MFG_PN01: RC-01W1501FT; CAD_APPROVED: Yes; FPLIST: RC0402_25,RC0402_HD,0402_CC,RC0402_X2; VOLTAGE: 50V; Value: 1.5K; ROHS: Yes; Temp_Range: -55C to +155C; HEIGHT: 0.41mm; PCB Footprint: R0201
R2998 = RES: 0402,0Ohm,+/-1%; Part Reference: R2998; CLASS: DISCRETE; VOLTAGE: 1/16W; Tolerance: 5%; MFG_NAME01: FENGHUA; MFG_PN01: RC-02000FT; CAD_APPROVED: Yes; FPLIST: RC0402_25,RC0402_HD,RC0402_X2,0402_CC; Value: 0R; HEIGHT: 0.45 MM; ROHS: Yes; PCB Footprint: R0402
R2999 = RES: 0402,0Ohm,+/-1%; Part Reference: R2999; CLASS: DISCRETE; FPLIST: RC0402_25,RC0402_HD,RC0402_X2,0402_CC; CAD_APPROVED: Yes; MFG_PN01: RC-02000FT; MFG_NAME01: FENGHUA; Tolerance: 5%; VOLTAGE: 1/16W; Value: 0R; ROHS: Yes; HEIGHT: 0.45 MM; PCB Footprint: R0402
R3000 = RES: 0402,0Ohm,+/-1%; Part Reference: R3000; CLASS: DISCRETE; VOLTAGE: 1/16W; Tolerance: 5%; MFG_NAME01: FENGHUA; MFG_PN01: RC-02000FT; CAD_APPROVED: Yes; FPLIST: RC0402_25,RC0402_HD,RC0402_X2,0402_CC; Value: 0R; HEIGHT: 0.45 MM; ROHS: Yes; PCB Footprint: R0402
R3001 = RES: 0402,0Ohm,+/-1%; Part Reference: R3001; CLASS: DISCRETE; VOLTAGE: 1/16W; Tolerance: 5%; MFG_NAME01: FENGHUA; MFG_PN01: RC-02000FT; CAD_APPROVED: Yes; FPLIST: RC0402_25,RC0402_HD,RC0402_X2,0402_CC; Value: 0R; HEIGHT: 0.45 MM; ROHS: Yes; PCB Footprint: R0402
TP928 = TESTLOOP: no part to order; Part Reference: TP928; CLASS: IO; ASSY_OPT: DNP; MFG_NAME01: NOT A COMPONENT; CAD_APPROVED: Yes; MFG_PN01: NOT A COMPONENT; ROHS: Yes; HEIGHT: 0.1MM; PCB Footprint: tpad_015
TP932 = TESTLOOP: no part to order; Part Reference: TP932; CLASS: IO; ASSY_OPT: DNP; CAD_APPROVED: Yes; MFG_PN01: NOT A COMPONENT; HEIGHT: 0.1MM; ROHS: Yes; MFG_NAME01: NOT A COMPONENT; PCB Footprint: tpad_015
TP933 = TESTLOOP: no part to order; Part Reference: TP933; CLASS: IO; ASSY_OPT: DNP; CAD_APPROVED: Yes; MFG_PN01: NOT A COMPONENT; HEIGHT: 0.1MM; ROHS: Yes; MFG_NAME01: NOT A COMPONENT; PCB Footprint: tpad_015
TP1031 = T POINT R: no part to order; Part Reference: TP1031; ASSY_OPT: DNP; CLASS: IC; CAD_APPROVED: Yes; MFG_PN01: NOT A COMPONENT; HEIGHT: 0.1MM; ROHS: Yes; MFG_NAME01: NOT A COMPONENT; PCB Footprint: tpad_020
TP1032 = T POINT R: no part to order; Part Reference: TP1032; ASSY_OPT: DNP; CLASS: IC; CAD_APPROVED: Yes; MFG_PN01: NOT A COMPONENT; HEIGHT: 0.1MM; ROHS: Yes; MFG_NAME01: NOT A COMPONENT; PCB Footprint: tpad_020
TP1033 = T POINT R: no part to order; Part Reference: TP1033; ASSY_OPT: DNP; CLASS: IC; MFG_NAME01: NOT A COMPONENT; CAD_APPROVED: Yes; MFG_PN01: NOT A COMPONENT; ROHS: Yes; HEIGHT: 0.1MM; PCB Footprint: tpad_020
TP1034 = T POINT R: no part to order; Part Reference: TP1034; ASSY_OPT: DNP; CLASS: IC; CAD_APPROVED: Yes; MFG_PN01: NOT A COMPONENT; HEIGHT: 0.1MM; ROHS: Yes; MFG_NAME01: NOT A COMPONENT; PCB Footprint: tpad_020
U708 = SGM8709YN5G: SGM8709YN5G/TR,SOT-23-5,Single channel comparator; Part Reference: U708; CLASS: IC; MFG_NAME01: SGMICRO; Temp_Range: -40C to +85C; CAD_APPROVED: Yes; VOLTAGE: 1.4-5.5V; Value: SGM8709YN5G; MFG_PN01: SGM8709YN5G/TR; ROHS: Yes; HEIGHT: 1.25MM; Temp Range: -40C to +85C; PCB Footprint: SOT-23-5
U709 = NX20P0407_WLCSP12_A: IC USB TYPE C PROTECTION +15KV/+8KV ESD WLCSP12; Manufacturer: NXP Semiconductors; Manufacturer Part Number: NX20P5090UK; Part Reference: U709; Temp Range: -40C to +85C; PRE_APN: 312-81846; CAD_APPROVED: Yes; CLASS: IC; Value: NX20P0407; MFG_PN01: NX20P0407; MFG_NAME01: NXP SEMICONDUCTORS; VOLTAGE: +15KV/+8KV; ROHS: Yes; HEIGHT: 0.565 MM; PCB Footprint: wlcsp12_0p4_1p3x1p7mm_smdp
U710 = NX20P3483UK_42P: IC USB PD/TYPE-C PWR Sink/Source Combo SW 5A 2.8-20V WLCSP42; Manufacturer: NXP Semiconductors; Manufacturer Part Number: NX20P5090UK; Part Reference: U710; CAD_APPROVED: Yes; PRE_APN: 315-81752; Temp_Range: -40C to +85C; CLASS: IC; Value: NX20P3483UK; HEIGHT: 0.565MM; ROHS: Yes; MFG_PN01: NX20P3483UK; MFG_NAME01: NXP SEMICONDUCTORS; PCB Footprint: wlcsp42_0p4_2p94x2p54_smdp
U711 = PESD1USB30_5P: IC EMI FILTER ESD PROTECTION 15kV/LINE WLCSP5; Manufacturer: NXP Semiconductors; Part Reference: U711; MFG_PN01: PCMF1USB3SZ; MFG_NAME01: NEXPERIA; CAD_APPROVED: Yes; Manufacturer Part Number: PESD1USB30; CLASS: IC; Value: PCMF1USB3S; 3D_Mechanical_Footprint_File: http://fcl.am.freescale.net/ALLEGRO/step/wlcsp5_0p4_0p82x1p22.STEP; ROHS: Yes; HEIGHT: 0.6MM; PCB Footprint: wlcsp5_0p4_0p82x1p22
U712 = PTN5110_QFN16: IC USB PD PHY 1PORT 2.7-5.5V HX2QFN16; Part Reference: U712; MFG_NAME01: NXP SEMICONDUCTORS; Temp_Range: ¨C40C to +85C; CAD_APPROVED: Yes; CLASS: IC; Value: PTN5110; ROHS: Yes; HEIGHT: 0.4MM; VOLTAGE: 2.7-5.5V; Temp Range: ¨C40C to +85C; PCB Footprint: hx2qfn16_0p4_2p7x2p7